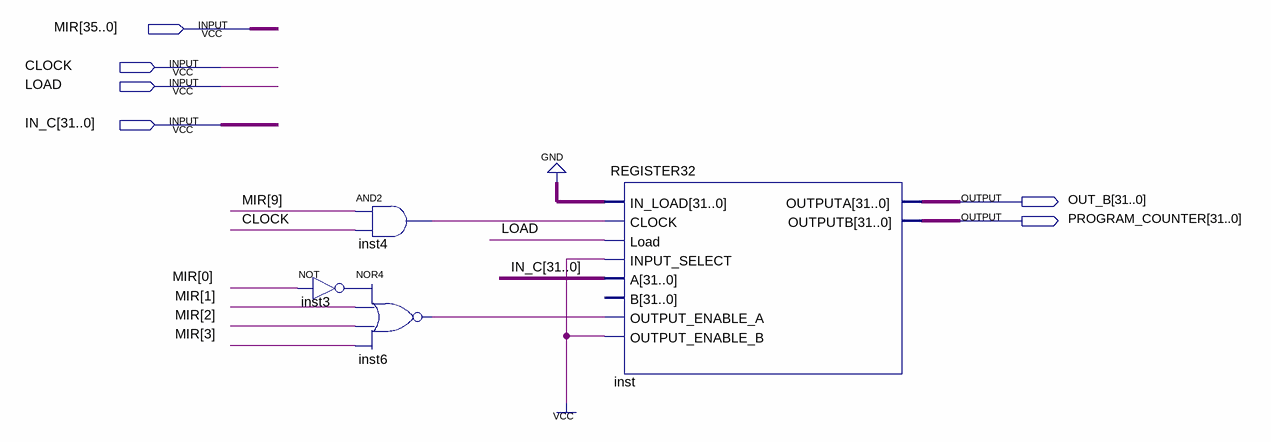
[diagram p0: schematic sheet]
// Quartus schematic PC.bdf as structural Verilog: 4 symbols, 6 pins
module PC (
  input  [35:0] MIR,
  input  CLOCK,
  input  LOAD,
  input  [31:0] IN_C,
  output [31:0] OUT_B,
  output [31:0] PROGRAM_COUNTER
);

  wire inst3_out, inst4_out, inst6_out;

  not inst3 (inst3_out, MIR[0]);
  and inst4 (inst4_out, MIR[9], CLOCK);
  nor inst6 (inst6_out, inst3_out, MIR[1], MIR[2], MIR[3]);
  REGISTER32 inst (
    .IN_LOAD({32{1'b0}}), .CLOCK(inst4_out), .Load(LOAD), .INPUT_SELECT(1'b1), .A(IN_C),
    .OUTPUT_ENABLE_A(inst6_out), .OUTPUT_ENABLE_B(1'b1), .OUTPUTA(OUT_B), .OUTPUTB(PROGRAM_COUNTER));  // open: B
endmodule
